# Altium project cap_bank_switcher.PrjPcb
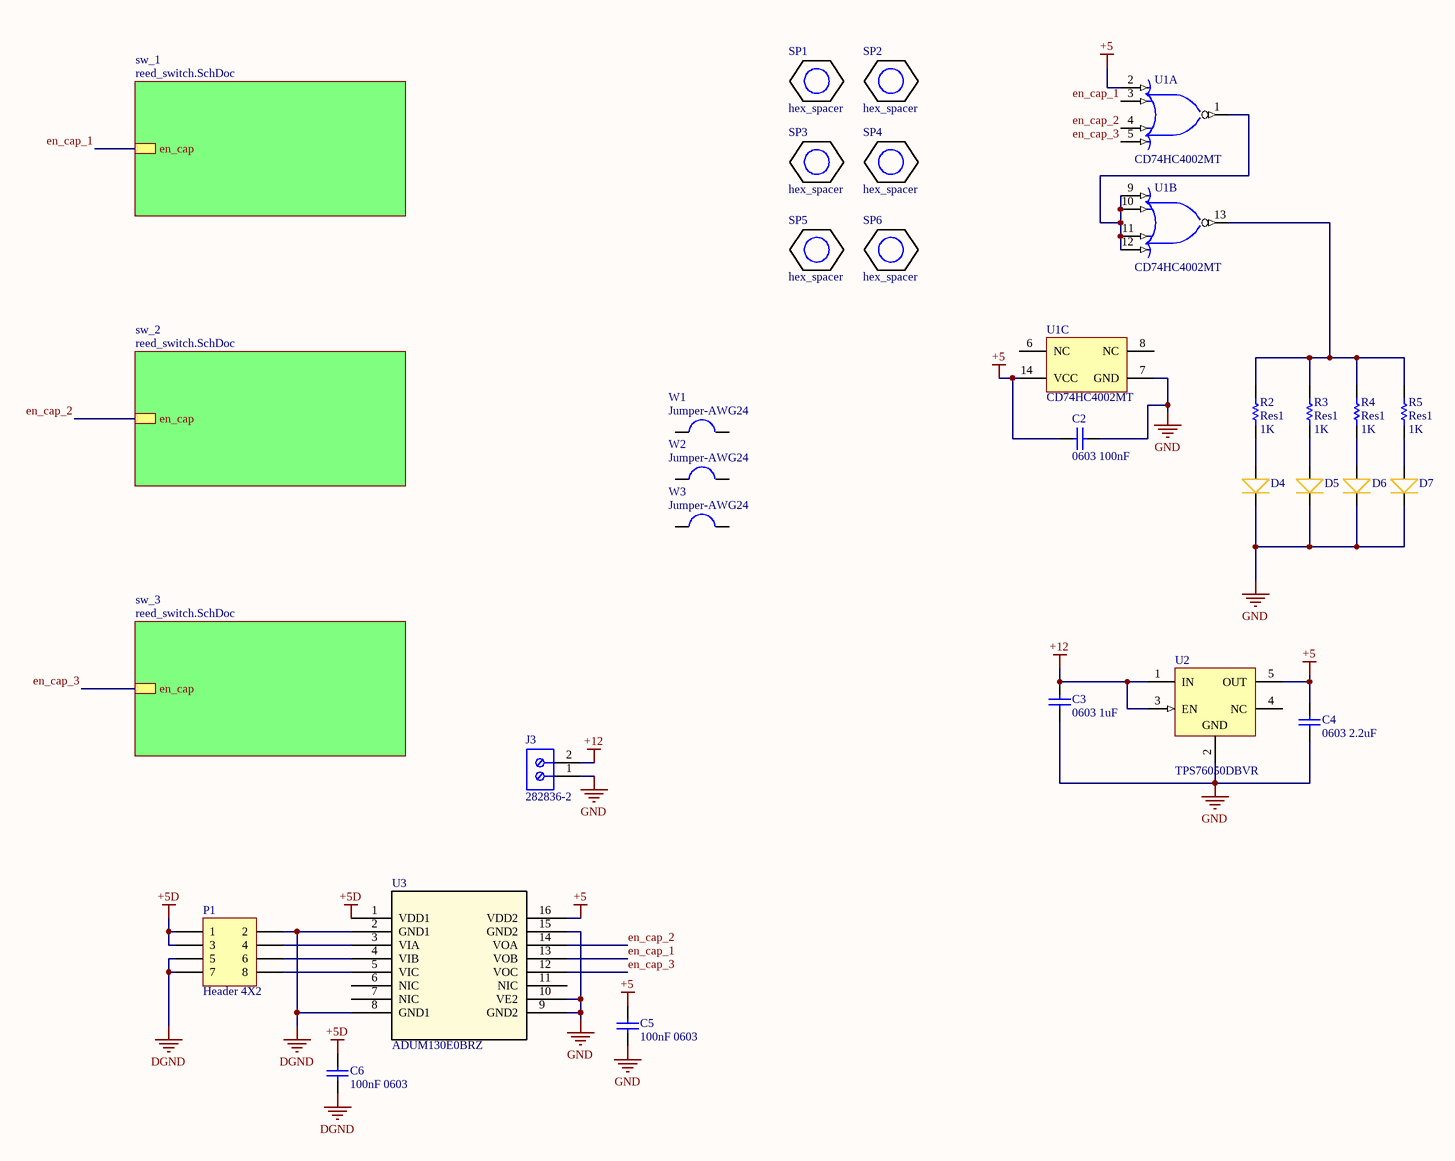
[diagram p0: main.SchDoc]
2 sheets, 66 parts. Net scope: hierarchical (ports join the sheet entries above them; power ports are global).
Board file: main.PcbDoc
Sheets:
  main.SchDoc
    sw_2 = reed_switch.SchDoc
    sw_1 = reed_switch.SchDoc
    sw_3 = reed_switch.SchDoc

## Sheet main.SchDoc
size A3; SheetNumber: 1; SheetTotal: 2

### Parts
C2  0603 100nF  [CAP 0603_1608]
C3  0603 1uF  [CAP 0603_1608]
C4  0603 2.2uF  [CAP 0603_1608]
C5  100nF 0603  [CAP 0603_1608]
C6  100nF 0603  [CAP 0603_1608]
D4  732-12018-1-ND  [LED_YELLOW_0603]  (value not drawn)
D5  732-12018-1-ND  [LED_YELLOW_0603]  (value not drawn)
D6  732-12018-1-ND  [LED_YELLOW_0603]  (value not drawn)
D7  732-12018-1-ND  [LED_YELLOW_0603]  (value not drawn)
J3  282836-2  [TECO-282836-2_V]
P1  Header 4X2  [HEADER_4_2]
R2  Res1  value 1K  [RES 0603_1608]
R3  Res1  value 1K  [RES 0603_1608]
R4  Res1  value 1K  [RES 0603_1608]
R5  Res1  value 1K  [RES 0603_1608]
SP1  hex_spacer  [hex_spacer]
SP2  hex_spacer  [hex_spacer]
SP3  hex_spacer  [hex_spacer]
SP4  hex_spacer  [hex_spacer]
SP5  hex_spacer  [hex_spacer]
SP6  hex_spacer  [hex_spacer]
U1  CD74HC4002MT  [D0014A_N]  (parts A,B,C of 3)
U2  TPS76050DBVR  [DBV0005A_L]
U3  ADUM130E0BRZ  [R_16]
W1  wire_jumper  [wire_jumper]  (value not drawn)
W2  wire_jumper  [wire_jumper]  (value not drawn)
W3  wire_jumper  [wire_jumper]  (value not drawn)

### Sub-sheets
sw_1 = reed_switch.SchDoc: en_cap
sw_2 = reed_switch.SchDoc: en_cap
sw_3 = reed_switch.SchDoc: en_cap

### Nets
+5: C2.2 C4.2 C5.2 U1.2(1A) U1.14(VCC) U2.5(OUT) U3.16(VDD2)
+5D: C6.2 P1.1 P1.3 U3.1(VDD1)
+12: C3.2 J3.2 U2.1(IN) U2.3(EN)
DGND: C6.1 P1.2 P1.5 P1.7 U3.2(GND1) U3.8(GND1)
GND: C2.1 C3.1 C4.1 C5.1 D4.C D5.C D6.C D7.C J3.1 U1.7(GND) U2.2(GND) U3.9(GND2) U3.10(VE2) U3.15(GND2)
en_cap_1: U1.3(1B) U3.13(VOB) ; sheet sw_1/en_cap
en_cap_2: U1.4(1C) U3.14(VOA) ; sheet sw_2/en_cap
en_cap_3: U1.5(1D) U3.12(VOC) ; sheet sw_3/en_cap
NetD4_A: D4.A R2.1
NetD5_A: D5.A R3.1
NetD6_A: D6.A R4.1
NetD7_A: D7.A R5.1
NetP1_4: P1.4 U3.3(VIA)
NetP1_6: P1.6 U3.4(VIB)
NetP1_8: P1.8 U3.5(VIC)
NetR2_2: R2.2 R3.2 R4.2 R5.2 U1.13(2Y)
NetU1_1: U1.1(1Y) U1.9(2A) U1.10(2B) U1.11(2C) U1.12(2D)

Not connected (* = marked no-connect by the designer): U1 6(NC) 8(NC); U2 4(NC); U3 6(NIC) 7(NIC) 11(NIC); W1 1 2; W2 1 2; W3 1 2

### Notes on the sheet
- 1
- 2
- 3
- 4
- 5
- 6
- 7
- 8
- A
- B
- C
- D
- Project:
- Date:
- Drawing number:
- Rev:
- Format:
- A3
- Drawn by:
- Laboratory:
- Page
- Sheet:
- of
- File:
- (in symbol wire_jumper) Jumper-AWG24

### Library data of the parts
C2-C6 = Cap: Capacitor; Published: 8-Jun-2000; LatestRevisionDate: 17-Jul-2002; LatestRevisionNote: Re-released for DXP Platform.; PackageReference: RAD-0.3; Publisher: Altium Limited; PackageDescription: Radial Cap, Thru-Hole; 2 Leads; 0.3 in Pin Spacing
  C5 C6: Value: 100nF
D4-D7 = led_yellow_0603: Supplier 1: Digi-Key; Supplier Part Number 1: 732-12018-1-ND
J3 = CMP-1684-00017-1: Female Header, Pitch 5 mm, 1 x 2 Position, Height 10 mm, Tail Length 3.5 mm, Rohs, Bulk; Manufacturer: TE Connectivity; Wire Gauge: 16-30AWG; Product Training Modules: Wire-to-BoardEurostyleTerminalBlocks; Clamp Material - Plating: Brass-NickelPlated; Voltage: 300V; Mating Orientation: HorizontalwithBoard; Current: 13.5A; Pitch: 0.197"(5.00mm); Screw Thread: M3; 3D Model: 282836-2.pdf; Other Names: 5ULV-02B / A98076; Dynamic Catalog: BuchananSeries; Number of Levels: 1; Torque - Screw: 0.68Nm(6Lb-In); Featured Product: EurostyleTerminalBlockConnectors; Positions Per Level: 2; Wire Termination: Screw-RisingCageClamp; Datasheet URL: http://www.te.com.cn/commerce/DocumentDelivery/DDEController?Action=showdoc&DocId=Catalog+Section%7F1308389_EUROSTYLE_TERMINAL_BLOCKS%7F0607%7Fpdf%7FEnglish%7FENG_CS_1308389_EUROSTYLE_TERMINAL_BLOCKS_0607.pdf%7F282836-2; Color: Green; Family: TerminalBlocks-WiretoBoard; RoHS Information: 282836-2StatementofCompliance; Standard Package: 300; Contact Material - Plating: Brass-TinPlated; Manufacturer URL: http://www.te.com; Housing Material: Polyamide(PA66),Nylon6/6; Features: Interlocking(Side); Package Description: Female Header, Pitch 5 mm, 1 x 2 Position, Height 10 mm, Tail Length 3.5 mm; Mounting Type: ThroughHole; Package Reference: THD; Packaging: Bulk; Series: Buchanan; Category: Connectors,Interconnects; Screw Material - Plating: Brass-NickelPlated
P1 = Header 4X2: Header, 4-Pin, Dual row; LatestRevisionDate: 17-Jul-2002; LatestRevisionNote: Re-released for DXP Platform.; Publisher: Altium Limited
R2-R5 = Res1: Resistor; Published: 8-Jun-2000; LatestRevisionDate: 17-Jul-2002; LatestRevisionNote: Re-released for DXP Platform.; PackageReference: AXIAL-0.3; Publisher: Altium Limited; PackageDescription: Axial Device, Thru-Hole; 2 Leads; 0.3 in Pin Spacing
U1 = CMP-0806-00012-3: High Speed CMOS Logic Dual 4-Input NOR Gates, D0014A, SMALL T&R; Manufacturer: Texas Instruments; tpd @ Nom Voltage(Max)(ns): 25; Rating: Catalog; VCC(Min)(V): 2; VCC(Max)(V): 6; Voltage(Nom)(V): 5; Output Drive (IOL/IOH)(Max)(mA): 5.2/-5.2; F @ Nom Voltage(Max)(Mhz): 70; ICC @ Nom Voltage(Max)(mA): 0.02; Code_JEDEC: MS-012; DatasheetVersion: SCHS197E; Operating Temperature Range(C): -55 to 125; PackageVersion: http://www.ti.com/lit/ml/mpds177g/mpds177g.pdf; Input Type: CMOS; Output Type: CMOS; Generic Part Number: CD74HC4002; Bits(#): 2; PackageReference: D0014A
U2 = CMP-0394-00477-2: Single Output LDO, 50 mA, Fixed 5 V Output, 5.2 to 16 V Input, with Low IQ, 5-pin SOT-23 (DBV), -40 to 125 degC, Green (RoHS & no Sb/Br); Manufacturer: Texas Instruments; Rating: Catalog; Fixed Output Options(V): 5; Vdo(Typ)(mV): 120; SubFamily: Single Channel LDO; Vin(Max)(V): 16; Accuracy(%): 2; Vin(Min)(V): 5.2; Iq(Typ)(mA): 0.8; Iout(Max)(A): 0.05; Mounting Technology: Surface Mount; ComponentLink1Description: Manufacturer URL; ComponentLink2URL: http://www.ti.com/general/docs/lit/getliterature.tsp?genericPartNumber=TPS76050&fileType=pdf; ComponentLink1URL: http://www.ti.com/; Vout Adj(Max)(V): 5; ComponentLink2Description: Datasheet; PackageReference: DBV0005A; Code_JEDEC: MO-178; Eco-Plan: Green (RoHS & no Sb/Br); ComponentLink3URL: http://www.ti.com/litv/pdf/mpds018i; PackageVersion: 4073253-4/K; ComponentLink3Description: Package Specification; PartNumber: TPS76050DBVR; Vout Adj(Min)(V): 5; PackageDescription: 5-Pin Plastic Small Outline, Body 1.60 Ãƒâ€” 2.90 mm, Pitch 0.95 mm; DatasheetVersion: SLVS144D
U3 = ADUM130E0BRZ: No Description Available; Mfr_Name: Analog Devices Inc; Copyright: Copyright (C) 2021 Ultra Librarian. All rights reserved.; Manufacturer_Part_Number: ADUM130E0BRZ; Digi-Key_Part_Number_1: ADUM130E0BRZ-ND; RefDes: RefDes; Type: DEV

## Sheet reed_switch.SchDoc
size A3; SheetNumber: 2; SheetTotal: 2
Used 3 times, as channels sw_2, sw_1, sw_3. Parts and nets are listed once, with the designators drawn on the sheet.
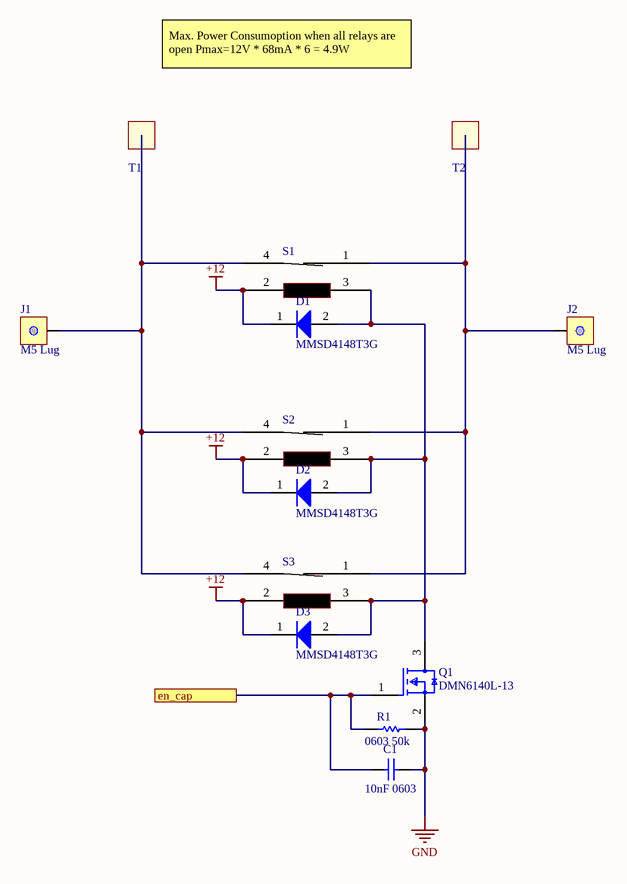
[diagram p1: reed_switch.SchDoc]

### Parts
C1  10nF 0603  [CAP 0603_1608]
D1  MMSD4148T3G  [ONSC-SOD-123-2-425-04_V]
D2  MMSD4148T3G  [ONSC-SOD-123-2-425-04_V]
D3  MMSD4148T3G  [ONSC-SOD-123-2-425-04_V]
J1  M5 Lug  [lug_pad_10mm_m5]
J2  M5 Lug  [lug_pad_10mm_m5]
Q1  DMN6140L-13  [FP-SOT23-MFG]
R1  0603 50k  [RES 0603_1608]
S1  Reed Relay 5A 3500kV / 7500kV (AC & DC)  [reed_relay_comus_3350-4275-126]  (value not drawn)
S2  Reed Relay 5A 3500kV / 7500kV (AC & DC)  [reed_relay_comus_3350-4275-126]  (value not drawn)
S3  Reed Relay 5A 3500kV / 7500kV (AC & DC)  [reed_relay_comus_3350-4275-126]  (value not drawn)
T1  pwr_connector_quick  [pcb_quick_power_connector]  (value not drawn)
T2  pwr_connector_quick  [pcb_quick_power_connector]  (value not drawn)

### Ports
en_cap

### Nets
+12: D1.1(K) D2.1(K) D3.1(K) S1.2 S2.2 S3.2
GND: C1.2 Q1.2(S) R1.2
en_cap: C1.1 Q1.1(G) R1.1 ; port en_cap
NetD1_2: D1.2(A) D2.2(A) D3.2(A) Q1.3(D) S1.3 S2.3 S3.3
NetJ1_1: J1.1 S1.4 S2.4 S3.4 T1.1
NetJ2_1: J2.1 S1.1 S2.1 S3.1 T2.1

### Channels
sw_2: designators end in _sw_2; ports en_cap=en_cap_2
sw_1: designators end in _sw_1; ports en_cap=en_cap_1
sw_3: designators end in _sw_3; ports en_cap=en_cap_3

### Notes on the sheet
- Max. Power Consumoption when all relays are open Pmax=12V * 68mA * 6 = 4.9W
- 1
- 2
- 3
- 4
- 5
- 6
- 7
- 8
- A
- B
- C
- D
- Project:
- Date:
- Drawing number:
- Rev:
- Format:
- A3
- Drawn by:
- Laboratory:
- Page
- Sheet:
- of
- File:

### Library data of the parts
C1 = Cap: Capacitor; Published: 8-Jun-2000; LatestRevisionDate: 17-Jul-2002; LatestRevisionNote: Re-released for DXP Platform.; PackageReference: RAD-0.3; Publisher: Altium Limited; PackageDescription: Radial Cap, Thru-Hole; 2 Leads; 0.3 in Pin Spacing; Value: 10nF
D1-D3 = CMP-0895-00002-2: Switching Diode, 2-Pin SOD-123, Pb-Free, Tape and Reel; Manufacturer: On Semiconductor; Configuration: Single; trr Max (ns): 4; IF Max (A): 0.2; ComponentLink1Description: Manufacturer URL; PackageReference: SOD-123-2-425-04; ComponentLink2Description: Datasheet; PackageVersion: Rev. G, 10/2009; PartNumber: MMSD4148T3G; ComponentLink3Description: Package Specification; ComponentLink1URL: http://www.onsemi.com/; PackageDescription: 2-Pin SOD, Body 1.6 x 2.69 mm; DatasheetVersion: Rev. 11; Packing: Tape and Reel; RoHS: TRUE; ComponentLink2URL: http://www.onsemi.com/pub_link/Collateral/MMSD4148T1-D.PDF; Mounting Technology: Surface Mount; ComponentLink3URL: http://www.onsemi.com/pub_link/Collateral/425-04.PDF
J1 J2 = lug_pad_10mm_m5
Q1 = CMP-12801-000047-1: MOSFET N-CH 60V 1.6A SOT23; Manufacturer: Diodes Inc.; Turn Off Delay Time: 16.3ns; Power Dissipation: 0.7W; Pulse Drain Current: 10A; Number Of Channels: 1; Reverse Recovery Time: 16.8ns; Typ Forward Diode Voltage: 0.75V; Gate To Source Voltage: 20V; Rthja Max: 183°C/W; Gate Charge At Vgs: 8.6nC @ 10V; Drain To Source Resistance: 92mΩ; Depletion Mode: False; Max Junction Temp: +150°C; Max Forward Diode Voltage: 1V; Reverse Recovery Charge: 9nC; Input Capacitace At Vds: 315pF @ 40V; Standoff Height: 0.013mm; Threshold Vgs Max: 3V; Turn On Delay Time: 2.6ns; Mouser Description: MOSFET 31V to 99V N-Ch FET 60Vds 20Vgs 2.3A; ComponentLink2Description: Datasheet; Digikey Description: MOSFET N-CH 60V 1.6A SOT23; Lead Free: Yes; Category: Trans; Device Class L3: MOSFETs; Temperature Range High: +150°C; Octopart: https://octopart.com/dmn6140l-13-diodes+inc.-38898616; Drain To Source Voltage: 60V; ComponentLink2URL: https://www.diodes.com/assets/Datasheets/DMN6140L.pdf; Drain To Source Breakdown Voltage: 60V; Footprint Url: https://www.diodes.com/assets/Package-Files/SOT23.pdf; Package: SOT23; Continuous Drain Current: 1.6A; Device Class L1: Discrete Semiconductors; Device Class L2: Transistors; Number Of N Channels: 1; Temperature Range Low: -55°C; Height: 1.1mm; Manufacturer Part Number: DMN6140L-13; RoHS: TRUE; Temperature: -55°C to +150°C; Threshold Vgs Min: 1V; Automotive: No
R1 = Res1: Resistor; Published: 8-Jun-2000; LatestRevisionDate: 17-Jul-2002; LatestRevisionNote: Re-released for DXP Platform.; PackageReference: AXIAL-0.3; Publisher: Altium Limited; PackageDescription: Axial Device, Thru-Hole; 2 Leads; 0.3 in Pin Spacing; Value: 50k
S1-S3 = reed_relay_3350-4275-126: 3500kV (AC & DC) breaking capacity @ 200W / 7500kV (AC & DC) minimum dielectric strength; Supplier 1: Digi-Key; Supplier Part Number 1: 1835-1040-ND
T1 T2 = pwr_connector_quick: Supplier 1: Digi-Key; Supplier Part Number 1: WM2984CT-ND

## Nets that join several sheets
+12: main (C3.2 J3.2 U2.1 U2.3), sw_2 (6 pins), sw_1 (6 pins), sw_3 (6 pins)
GND: main (14 pins), sw_2 (C1_sw_2.2 Q1_sw_2.2 R1_sw_2.2), sw_1 (C1_sw_1.2 Q1_sw_1.2 R1_sw_1.2), sw_3 (C1_sw_3.2 Q1_sw_3.2 R1_sw_3.2)
en_cap_1: main (U1.3 U3.13), sw_1 (C1_sw_1.1 Q1_sw_1.1 R1_sw_1.1)
en_cap_2: main (U1.4 U3.14), sw_2 (C1_sw_2.1 Q1_sw_2.1 R1_sw_2.1)
en_cap_3: main (U1.5 U3.12), sw_3 (C1_sw_3.1 Q1_sw_3.1 R1_sw_3.1)